# Altium schematic sheet Supply.SchDoc: Power Supply
size A3; Author: M.Beldyga; CompanyName: WUT ISE; DrawnBy: M.Beldyga; Organization: WUT ISE; Address1: PW ISE; Address2: Nowowiejska 15/19 00-665 Warsaw; Address3: micbeldyga@gmail.com; SheetNumber: 8; SheetTotal: 8; ModifiedBy: -; CheckedDate: -; DivGrp: WUT ISE; Designer: M.Beldyga; ModifiedDate: -; ProjectName: Sensor Box
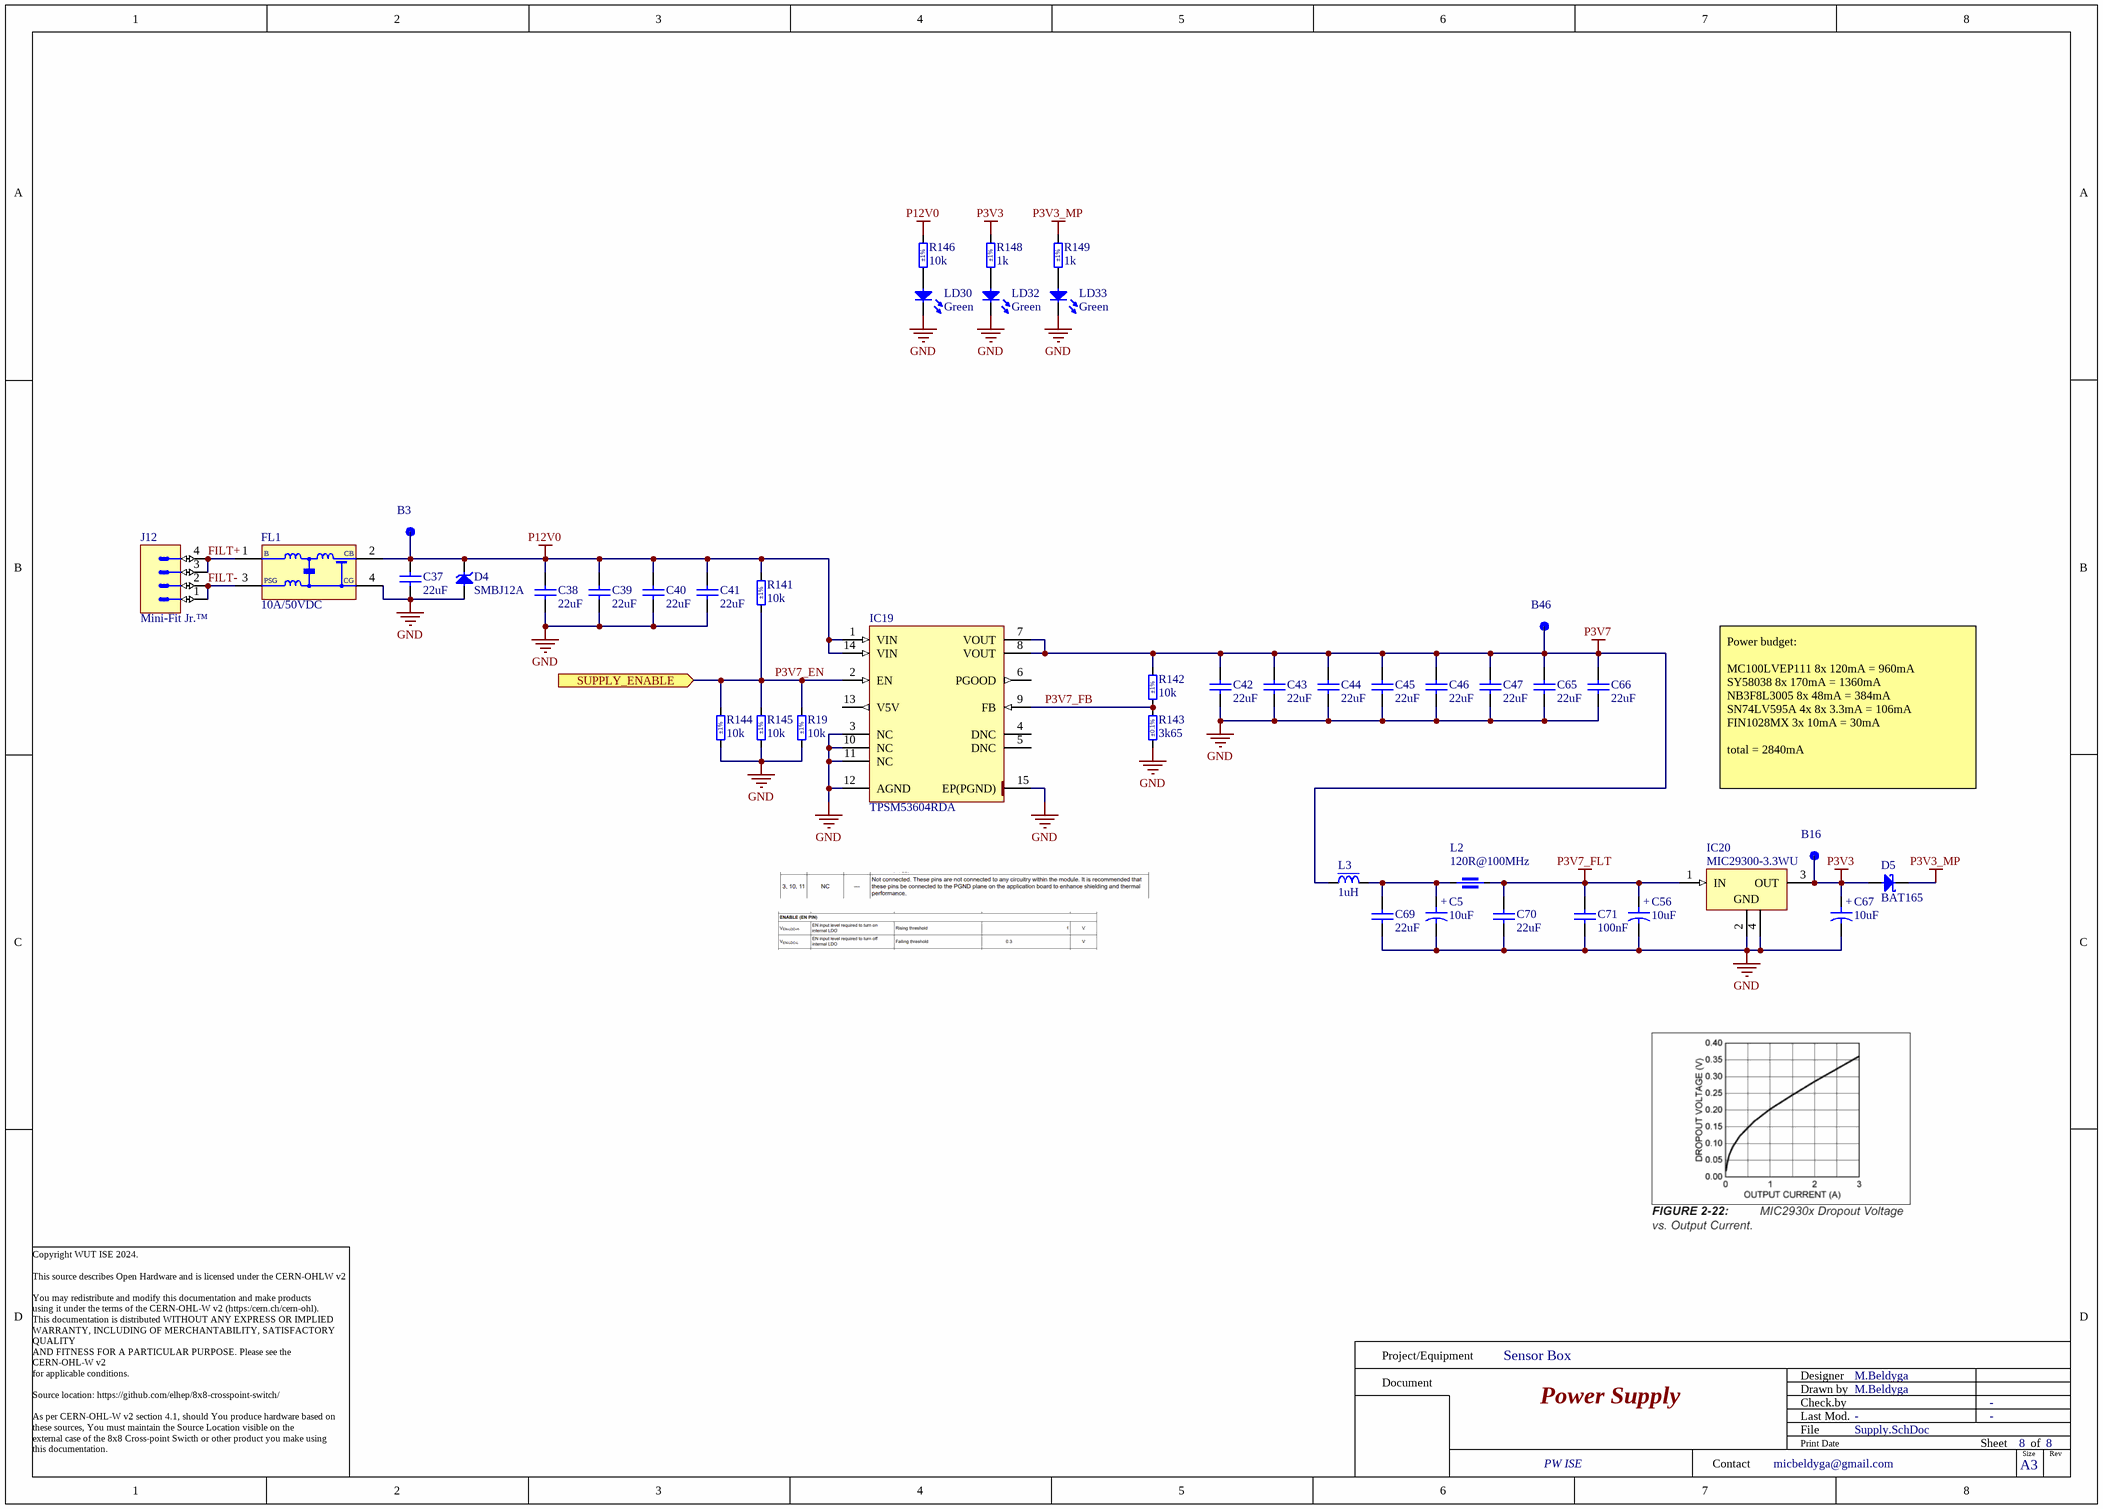
[diagram p0: Supply.SchDoc]

## Parts
B3  SMD Pad  [C100]  (value not drawn)  (no BOM)
B16  SMD Pad  [C100]  (value not drawn)  (no BOM)
B46  SMD Pad  [C100]  (value not drawn)  (no BOM)
C5  10uF  [CAPMP3216X180N]
C37  22uF  [CAPC2012X135N]
C38  22uF  [CAPC2012X135N]
C39  22uF  [CAPC2012X135N]
C40  22uF  [CAPC2012X135N]
C41  22uF  [CAPC2012X135N]
C42  22uF  [CAPC2012X135N]
C43  22uF  [CAPC2012X135N]
C44  22uF  [CAPC2012X135N]
C45  22uF  [CAPC2012X135N]
C46  22uF  [CAPC2012X135N]
C47  22uF  [CAPC2012X135N]
C56  10uF  [CAPMP3216X180N]
C65  22uF  [CAPC2012X135N]
C66  22uF  [CAPC2012X135N]
C67  10uF  [CAPMP3216X180N]
C69  22uF  [CAPC2012X135N]
C70  22uF  [CAPC2012X135N]
C71  100nF  [CAPC1005X55N]
D4  SMBJ12A  [DIOM5336X265N]
D5  BAT165  [SOD2512X110N]
FL1  10A/50VDC  [FIL_MURATA_BNX02]
IC19  TPSM53604RDA  [TEXAS_RDA0015A (B3QFN)]
IC20  MIC29300-3.3WU  [TO254P1524X460-4N-S769X1066]
J12  Mini-Fit Jr.™  [MOLEX_39-30-0040]
L2  120R@100MHz  [INDC1608X65N]
L3  1uH  [IND_COILCRAFT_PFL3215]
LD30  Green  [LED_KINGBRIGHT_KP-1608CGCK]
LD32  Green  [LED_KINGBRIGHT_KP-1608CGCK]
LD33  Green  [LED_KINGBRIGHT_KP-1608CGCK]
R19  10k  Tolerance: ±1%  [RESC1005X40N]
R141  10k  Tolerance: ±1%  [RESC1005X40N]
R142  10k  Tolerance: ±1%  [RESC1005X40N]
R143  3k65  Tolerance: ±0.1%  [RESC1608X55N]
R144  10k  Tolerance: ±1%  [RESC1005X40N]
R145  10k  Tolerance: ±1%  [RESC1005X40N]
R146  10k  Tolerance: ±1%  [RESC1005X40N]
R148  1k  Tolerance: ±1%  [RESC1005X40N]
R149  1k  Tolerance: ±1%  [RESC1005X40N]

## Ports
SUPPLY_ENABLE (in)

## Nets
GND: C5.2 C37.1 C38.1 C39.1 C40.1 C41.1 C42.1 C43.1 C44.1 C45.1 C46.1 C47.1 C56.2 C65.1 C66.1 C67.2 C69.1 C70.1 C71.1 D4.2(A) FL1.4(CG) IC19.3(NC) IC19.10(NC) IC19.11(NC) IC19.12(AGND) IC19.15(EP(PGND)) IC20.2(GND) IC20.4(GND) LD30.1(C) LD32.1(C) LD33.1(C) R19.2 R143.1 R144.2 R145.2
P3V3: B16.1 C67.1 D5.2(A) IC20.3(OUT) R148.2
P3V3_MP: D5.1(C) R149.2
P3V7: B46.1 C42.2 C43.2 C44.2 C45.2 C46.2 C47.2 C65.2 C66.2 IC19.7(VOUT) IC19.8(VOUT) L3.1 R142.1
P3V7_FLT: C56.1 C70.2 C71.2 IC20.1(IN) L2.2
P12V0: B3.1 C37.2 C38.2 C39.2 C40.2 C41.2 D4.1(C) FL1.2(CB) IC19.1(VIN) IC19.14(VIN) R141.1 R146.1
FILT+: FL1.1(B) J12.3 J12.4
FILT-: FL1.3(PSG) J12.1 J12.2
P3V7_EN: IC19.2(EN) R19.1 R141.2 R144.1 R145.1 ; port SUPPLY_ENABLE
P3V7_FB: IC19.9(FB) R142.2 R143.2
NetC5_1: C5.1 C69.2 L2.1 L3.2
NetLD30_2: LD30.2(A) R146.2
NetLD32_2: LD32.2(A) R148.1
NetLD33_2: LD33.2(A) R149.1

Not connected (* = marked no-connect by the designer): IC19 4(DNC) 5(DNC) 6(PGOOD) 13(V5V)

## Notes on the sheet
- Power budget:
  MC100LVEP111 8x 120mA = 960mA
  SY58038 8x 170mA = 1360mA
  NB3F8L3005 8x 48mA = 384mA
  SN74LV595A 4x 8x 3.3mA = 106mA
  FIN1028MX 3x 10mA = 30mA
  total = 2840mA
- Copyright WUT ISE 2024.
  This source describes Open Hardware and is licensed under the CERN-OHLW v2
  You may redistribute and modify this documentation and make products
  using it under the terms of the CERN-OHL-W v2 (https:/cern.ch/cern-ohl).
  This documentation is distributed WITHOUT ANY EXPRESS OR IMPLIED
  WARRANTY, INCLUDING OF MERCHANTABILITY, SATISFACTORY QUALITY
  AND FITNESS FOR A PARTICULAR PURPOSE. Please see the CERN-OHL-W v2
  for applicable conditions.
  Source location: https://github.com/elhep/8x8-crosspoint-switch/
  As per CERN-OHL-W v2 section 4.1, should You produce hardware based on
  these sources, You must maintain the Source Location visible on the
  external case of the 8x8 Cross-point Swicth or other product you make using
  this documentation.
- Project/Equipment
- Document
- Designer
- Drawn by
- Check.by
- Contact
- File
- Last Mod.
- Print Date
- Sheet
- Size
- A3
- of
- Rev
- (in symbol CTE3216-18_10UF_16V_20%_AVX_TCJ) +

## Library data of the parts
B3 B16 B46 = SMD_PAD_D1MM: Pad; Part Description: 1mm Diameter SMD Pad; Mounted: No; Part Number: SMD_PAD_D1MM; Component Type: Standard (No BOM); Pin Count: 1; Family: SMD Pad; Socket: No; SMD: Yes; Sense: No; Status: None; ComponentHeight: 0mm; HelpURL: Undefined; Author: CERN DEM JLC; CreateDate: 10/10/2017; LatestRevisionDate: 10/10/2017; PackageDescription: 1mm Diameter SMD Pad
C5 C56 C67 = CTE3216-18_10UF_16V_20%_AVX_TCJ: Polarised capacitor; Part Description: ESR 0R200 Tantalum Solid Electrolytic Chip Capacitor with Conductive Polymer Electrode; Manufacturer: AVX; Manufacturer Part Number: TCJA106M016R0200; Voltage: 16V; Tolerance: ±20%; Part Number: CTE3216-18_10UF_16V_20%_AVX_TCJ; Component Kind: Standard; Component Type: Standard; Pin Count: 2; Value: 10uF; Status: Preferred; Case: A; Mounted: Yes; Socket: No; SMD: Yes; Sense: No; ComponentHeight: 1.8mm; HelpURL: \\cern.ch\dfs\Applications\Altium\Datasheets\CTE_AVX_TCJ.pdf; Author: CERN DEM JLC; CreateDate: 3/29/2012; LatestRevisionDate: 3/29/2012
C37-C47 C65 C66 C69 C70 = CC0805_22UF_16V_10%_X5R: Non-polarised capacitor; Part Description: SMD Multilayer Chip Ceramic Capacitor; Manufacturer: GENERIC; Manufacturer1 Part Number: C2012X5R1C226KT; Voltage: 16V; TC: X5R; Tolerance: ±10%; Part Number: CC0805_22UF_16V_10%_X5R; Component Kind: Standard; Component Type: Standard; Pin Count: 2; Value: 22uF; Status: Preferred; Manufacturer Part Number: CC0805_22UF_16V_10%_X5R; Case: 0805; Mounted: Yes; Socket: No; SMD: Yes; Sense: No; Manufacturer1 Example: TDK; Manufacturer1 ComponentHeight: 1.35mm; HelpURL: \\cern.ch\dfs\Applications\Altium\Datasheets\CC0805_X5R_TDK_C.pdf; Author: CERN DEM JLC; CreateDate: 10/25/2012; LatestRevisionDate: 10/25/2012
C71 = CC0402_100NF_50V_10%_X7R: Non-polarised capacitor; Part Description: SMD Multilayer Chip Ceramic Capacitor; Manufacturer: GENERIC; Manufacturer1 Part Number: GRM155R71H104KE14D; Voltage: 50V; TC: X7R; Tolerance: ±10%; Part Number: CC0402_100NF_50V_10%_X7R; Component Kind: Standard; Component Type: Standard; Pin Count: 2; Value: 100nF; Status: None; Manufacturer Part Number: CC0402_100NF_50V_10%_X7R; Case: 0402; Mounted: Yes; Socket: No; SMD: Yes; Sense: No; Manufacturer1 Example: MURATA; Manufacturer1 ComponentHeight: 0.55mm; HelpURL: \\cern.ch\dfs\Applications\Altium\Datasheets\CC0402_MURATA_GRM155R71H104KE14D.pdf; Author: CERN DEM MR; CreateDate: 6/30/2017; LatestRevisionDate: 6/30/2017
D4 = SMBJ12A: Zener Diode; Part Description: Uni-Directional Transient Voltage Suppressor Diode; Manufacturer: FAIRCHILD SEMICONDUCTOR; Voltage: 12V; Power: 600W; PressFit: No; Bonding: No; Part Number: SMBJ12A; Component Kind: Standard; Component Type: Standard; Device: SMBJ12A; PackageDescription: DO-214-AA/SMB Diode, Molded Body; 5.34mm L X 3.625mm W X 2.65mm H, IPC Medium Density; Manufacturer Part Number: SMBJ12A; Pin Count: 2; Case: DO-214AA; Mounted: Yes; Socket: No; SMD: Yes; Sense: No; ComponentHeight: 2.65mm; HelpURL: \\cern.ch\dfs\Applications\Altium\Datasheets\SMBJ.pdf; Author: CERN DEM JLC; CreateDate: 4/10/2013; LatestRevisionDate: 4/10/2013
D5 = BAT165: Schottky Diode; Part Description: Medium Power AF Schottky Diode; Manufacturer: INFINEON; Voltage: 40V; Power: 750mA; PressFit: No; Bonding: No; Part Number: BAT165; Component Kind: Standard; Component Type: Standard; Device: BAT165; PackageDescription: Small Outline Diode (SOD-323), 1.70mm W X 1.25mm L X 1.10mm H body,  IPC Medium Density; Manufacturer Part Number: BAT165; Pin Count: 2; Case: SOD-323; Mounted: Yes; Socket: No; SMD: Yes; Sense: No; ComponentHeight: 1.1mm; HelpURL: \\cern.ch\dfs\Applications\Altium\Datasheets\BAT165.pdf; Author: CERN DEM JLC; CreateDate: 11/12/2014; LatestRevisionDate: 11/12/2014
FL1 = FIL_MURATA_BNX022-01L: Block Type EMIFIL (LC Combined); Part Description: Block Type EMIFIL (LC Combined) SMD Type, BNX02* Series; Manufacturer: MURATA; Resistance: 0.5R; Part Number: FIL_MURATA_BNX022-01L; Component Kind: Standard; Component Type: Standard; Pin Count: 2; Value: 10A/50VDC; Manufacturer Part Number: BNX022-01L; Mounted: Yes; Socket: No; SMD: Yes; Sense: No; ComponentHeight: 3.3mm; HelpURL: \\cern.ch\dfs\Applications\Altium\Datasheets\FIL_MURATA_BNX022-01L.pdf; Author: CERN DEM JLC; CreateDate: 10/10/2012; LatestRevisionDate: 10/10/2012
IC19 = TPSM53604RDA: 3.8V to 36V Input, 1V to 7V Output, 4A Power Module in Enhanced HotRod™; Manufacturer: TEXAS INSTRUMENTS; PressFit: No; Bonding: No; Status Comment: Solder Paste Deposition Limitation; Part Number: TPSM53604RDA; Component Kind: Standard; Component Type: Standard; Device: TPSM53604RDA; PackageDescription: TEXAS Case Style RDA0015A, DFN, 0.65mm Pitch; 14 Pin, 5.00mm W X 5.50mm L X 4.10mm H body (w/Thermal Tab 2.55 X 4.65mm); Status: Not Recommended; Part Description: 3.8V to 36V Input, 1V to 7V Output, 4A Power Module in Enhanced HotRod™; Manufacturer Part Number: TPSM53604RDA; Pin Count: 15; Case: DFN14; Mounted: Yes; Socket: No; SMD: Yes; Sense: No; ComponentHeight: 4.1mm; HelpURL: \\cern.ch\dfs\Applications\Altium\Datasheets\TPSM53604RDA.pdf; Author: CERN DEM BC; CreateDate: 3/30/2021; LatestRevisionDate: 3/30/2021
IC20 = MIC29300-3.3WU: 3-Terminal Regulator 1=IN 2=GND 3=OUT 4=GND; Part Description: 3.3V, 3A, High-Current Low Dropout Regulator (RoHS); Manufacturer: MICREL; PressFit: No; Bonding: No; Part Number: MIC29300-3.3WU; Component Kind: Standard; Component Type: Standard; Device: MIC29300-3.3WU; PackageDescription: D2PAK TO-263, TO, 2.54mm Pitch; 4 Pin, 15.24mm L X 10.36mm W X 4.597mm H body, IPC Medium Density; Manufacturer Part Number: MIC29300-3.3WU; Pin Count: 4; Case: TO-263-3; Mounted: Yes; Socket: No; SMD: Yes; Sense: No; ComponentHeight: 4.6mm; HelpURL: \\cern.ch\dfs\Applications\Altium\Datasheets\MIC29300-3.3WU.pdf; Author: CERN DEM JLC; CreateDate: 8/22/2011; LatestRevisionDate: 8/8/2012
J12 = MOLEX_39-30-0040: Connector 4 Male; Part Description: 4.20mm (.165") Pitch Mini-Fit Jr. Header, Dual Row, Right Angle with Snap-in Plastic Peg PCB Lock, 4 Circuits; Manufacturer: MOLEX; PressFit: No; Part Number: MOLEX_39-30-0040; Component Kind: Standard; Component Type: Standard; Pin Count: 4; Family: Mini-Fit Jr.™; Mounted: Yes; Socket: No; SMD: No; Sense: No; Status: None; Manufacturer Part Number: 39-30-0040; ComponentHeight: 11.4mm; HelpURL: \\cern.ch\dfs\Applications\Altium\Datasheets\MOLEX_39-30-0040.pdf; Author: CERN DEM JLC; CreateDate: 10/2/2018; LatestRevisionDate: 10/2/2018
L2 = IND0603_MURATA_BLM18SG121TN1D: Part Description: SMD EMIFIL Suppression Chip Ferrite Bead; Manufacturer: MURATA; Power: 3A; Resistance: 0.025R; Tolerance: ±25%; Part Number: IND0603_MURATA_BLM18SG121TN1D; Component Kind: Standard; Component Type: Standard; Pin Count: 2; Value: 120R@100MHz; Manufacturer Part Number: BLM18SG121TN1D; Case: 0603; Mounted: Yes; Socket: No; SMD: Yes; Sense: No; ComponentHeight: 0.65mm; HelpURL: \\cern.ch\dfs\Applications\Altium\Datasheets\IND0603_MURATA_BLM18S.pdf; Author: CERN DEM JLC; CreateDate: 7/23/2014; LatestRevisionDate: 10/25/2018
L3 = IND_1UH_20%_COILCRAFT_PFL3215: Inductor With Core; Part Description: SMD Shielded Power Inductor; Manufacturer Part Number: PFL3215-102MEB; Power: 1.9A; Resistance: 0.038R; Tolerance: ±20%; Part Number: IND_1UH_20%_COILCRAFT_PFL3215; Component Kind: Standard; Component Type: Standard; Pin Count: 2; Value: 1uH; Manufacturer: COILCRAFT; Mounted: Yes; Socket: No; SMD: Yes; Sense: No; ComponentHeight: 1.5mm; HelpURL: \\cern.ch\dfs\Applications\Altium\Datasheets\IND_COILCRAFT_PFL3215.pdf; Author: CERN DEM MR; CreateDate: 3/14/2016; LatestRevisionDate: 3/14/2016
LD30 LD32 LD33 = LED_KINGBRIGHT_KP-1608CGCK: LED Green 1C 2A; Part Description: 1.6x0.8mm SMD Chip Green LED Lamp; PressFit: No; Bonding: No; Part Number: LED_KINGBRIGHT_KP-1608CGCK; Component Kind: Standard; Component Type: Standard; Color: Green; PackageDescription: SMT Green LED, Case 0603, Body L 1.60mm x W 0.80mm x H 1.10mm; Manufacturer: KINGBRIGHT; Manufacturer Part Number: KP-1608CGCK; Pin Count: 2; Case: 0603; Mounted: Yes; Socket: No; SMD: Yes; Sense: No; ComponentHeight: 1.1mm; HelpURL: \\cern.ch\dfs\Applications\Altium\Datasheets\LED_KINGBRIGHT_KP-1608CGCK.pdf; Author: CERN DEM HF; CreateDate: 10/1/2021; LatestRevisionDate: 10/1/2021
R19 R141 R142 R144-R146 = R0402_10K_1%_0.0625W_100PPM: Resistor - 1%; Part Description: General Purpose Thick Film Chip Resistor; Manufacturer: GENERIC; Manufacturer1 Part Number: 232270671003L; TC: ±100ppm/°C; PressFit: No; Part Number: R0402_10K_1%_0.0625W_100PPM; Component Kind: Standard; Component Type: Standard; Pin Count: 2; Value: 10k; Status: Not Recommended; Power: 0.0625W; Manufacturer Part Number: R0402_10K_1%_0.0625W_100PPM; Case: 0402; Mounted: Yes; Sense: No; Socket: No; SMD: Yes; Manufacturer1 Example: YAGEO PHYCOMP; Manufacturer1 ComponentHeight: 0.4mm; HelpURL: \\cern.ch\dfs\Applications\Altium\Datasheets\R0402_Phycomp_RC0402.pdf; Author: CERN DEM JLC; CreateDate: 12/3/2007; LatestRevisionDate: 10/17/2012
R143 = R0603_3K65_0.1%_0.063W_10PPM: Resistor - 0.1%; Part Description: Thin Film Chip Resistor; Manufacturer: GENERIC; Manufacturer1 Part Number: RN73C1J3K65BTDF; Power: 0.063W; TC: ±10ppm; PressFit: No; Part Number: R0603_3K65_0.1%_0.063W_10PPM; Component Kind: Standard; Component Type: Standard; Pin Count: 2; Value: 3k65; Status: Not Recommended; Manufacturer Part Number: R0603_3K65_0.1%_0.063W_10PPM; Case: 0603; Mounted: Yes; Sense: No; Socket: No; SMD: Yes; Manufacturer1 Example: TYCO HOLSWORTHY; Manufacturer1 ComponentHeight: 0.5mm; HelpURL: \\cern.ch\dfs\Applications\Altium\Datasheets\R0603_Tyco_RN73.pdf; Author: CERN DEM JLC; CreateDate: 12/3/2007; LatestRevisionDate: 3/13/2008
R148 R149 = R0402_1K_1%_0.0625W_100PPM: Resistor - 1%; Part Description: General Purpose Thick Film Chip Resistor; Manufacturer: GENERIC; Manufacturer1 Part Number: 232270671002L; TC: ±100ppm/°C; PressFit: No; Part Number: R0402_1K_1%_0.0625W_100PPM; Component Kind: Standard; Component Type: Standard; Pin Count: 2; Value: 1k; Status: Not Recommended; Power: 0.0625W; Manufacturer Part Number: R0402_1K_1%_0.0625W_100PPM; Case: 0402; Mounted: Yes; Sense: No; Socket: No; SMD: Yes; Manufacturer1 Example: YAGEO PHYCOMP; Manufacturer1 ComponentHeight: 0.4mm; HelpURL: \\cern.ch\dfs\Applications\Altium\Datasheets\R0402_Phycomp_RC0402.pdf; Author: CERN DEM JLC; CreateDate: 12/3/2007; LatestRevisionDate: 10/17/2012